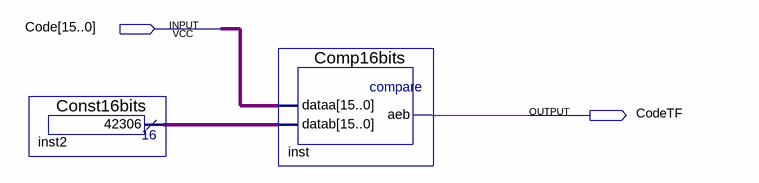
[diagram p0: schematic sheet]
// Quartus schematic Comparaison.bdf as structural Verilog: 2 symbols, 2 pins
module Comparaison (
  input  [15:0] Code,
  output CodeTF
);

  wire [15:0] inst2_result;

  Const16bits inst2 (.result(inst2_result));
  Comp16bits inst (.dataa(Code), .datab(inst2_result), .aeb(CodeTF));
endmodule
